# Altium schematic sheet Steering Wheel.SchDoc
size A4
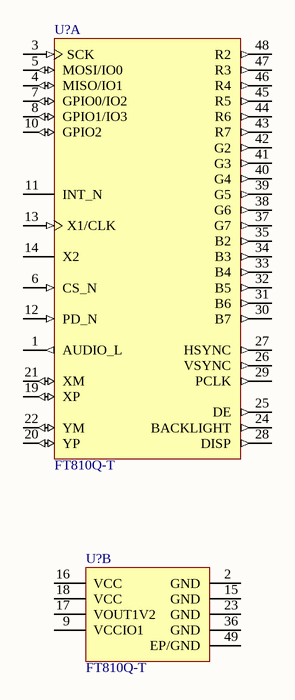
[diagram p0: Steering Wheel.SchDoc]

## Parts
(Parts that share a designator on the sheet are numbered #1, #2 ... from top to bottom, then left to right.)
U?#1  FT810Q-T  [VQFN-48_5.2x5.2EP]  (part A of 2)
U?#2  FT810Q-T  [VQFN-48_5.2x5.2EP]  (part B of 2)

## Nets

Not connected (* = marked no-connect by the designer): U?#1 1(AUDIO_L) 3(SCK) 4(MISO/IO1) 5(MOSI/IO0) 6(CS_N) 7(GPIO0/IO2) 8(GPIO1/IO3) 10(GPIO2) 11(INT_N) 12(PD_N) 13(X1/CLK) 14(X2) 19(XP) 20(YP) 21(XM) 22(YM) 24(BACKLIGHT) 25(DE) 26(VSYNC) 27(HSYNC) 28(DISP) 29(PCLK) 30(B7) 31(B6) 32(B5) 33(B4) 34(B3) 35(B2) 37(G7) 38(G6) 39(G5) 40(G4) 41(G3) 42(G2) 43(R7) 44(R6) 45(R5) 46(R4) 47(R3) 48(R2); U?#2 2(GND) 9(VCCIO1) 15(GND) 16(VCC) 17(VOUT1V2) 18(VCC) 23(GND) 36(GND) 49(EP/GND)

## Library data of the parts
U?#1 U?#2 = CMP-0582-00003-1: FT810 Single Chip Embedded Graphic Controller (Embedded Video Engine), 18-bit RGB, resistive touch, -40 to +85 degC, 48-pin VQFN, Pb-Free, Tray; Manufacturer: FTDI; DatasheetVersion: ver 1.2, Sep-2015; PackageReference: VQFN-48_5.2x5.2EP; ComponentLink2Description: Datasheet; ComponentLink1URL: http://www.ftdichip.com/; ComponentLink2URL: http://www.ftdichip.com/Support/Documents/DataSheets/ICs/DS_FT81x.pdf; PackageDescription: 48-Pin Very Thin Quad Flat No-Lead, 7 x 7 mm Body, 0.5 mm Pitch, 5.2 x 5.2 mm Exposed Pad; ComponentLink1Description: Manufacturer URL